# EAGLE design FilterSchematics1 (EAGLE 8.2.2)
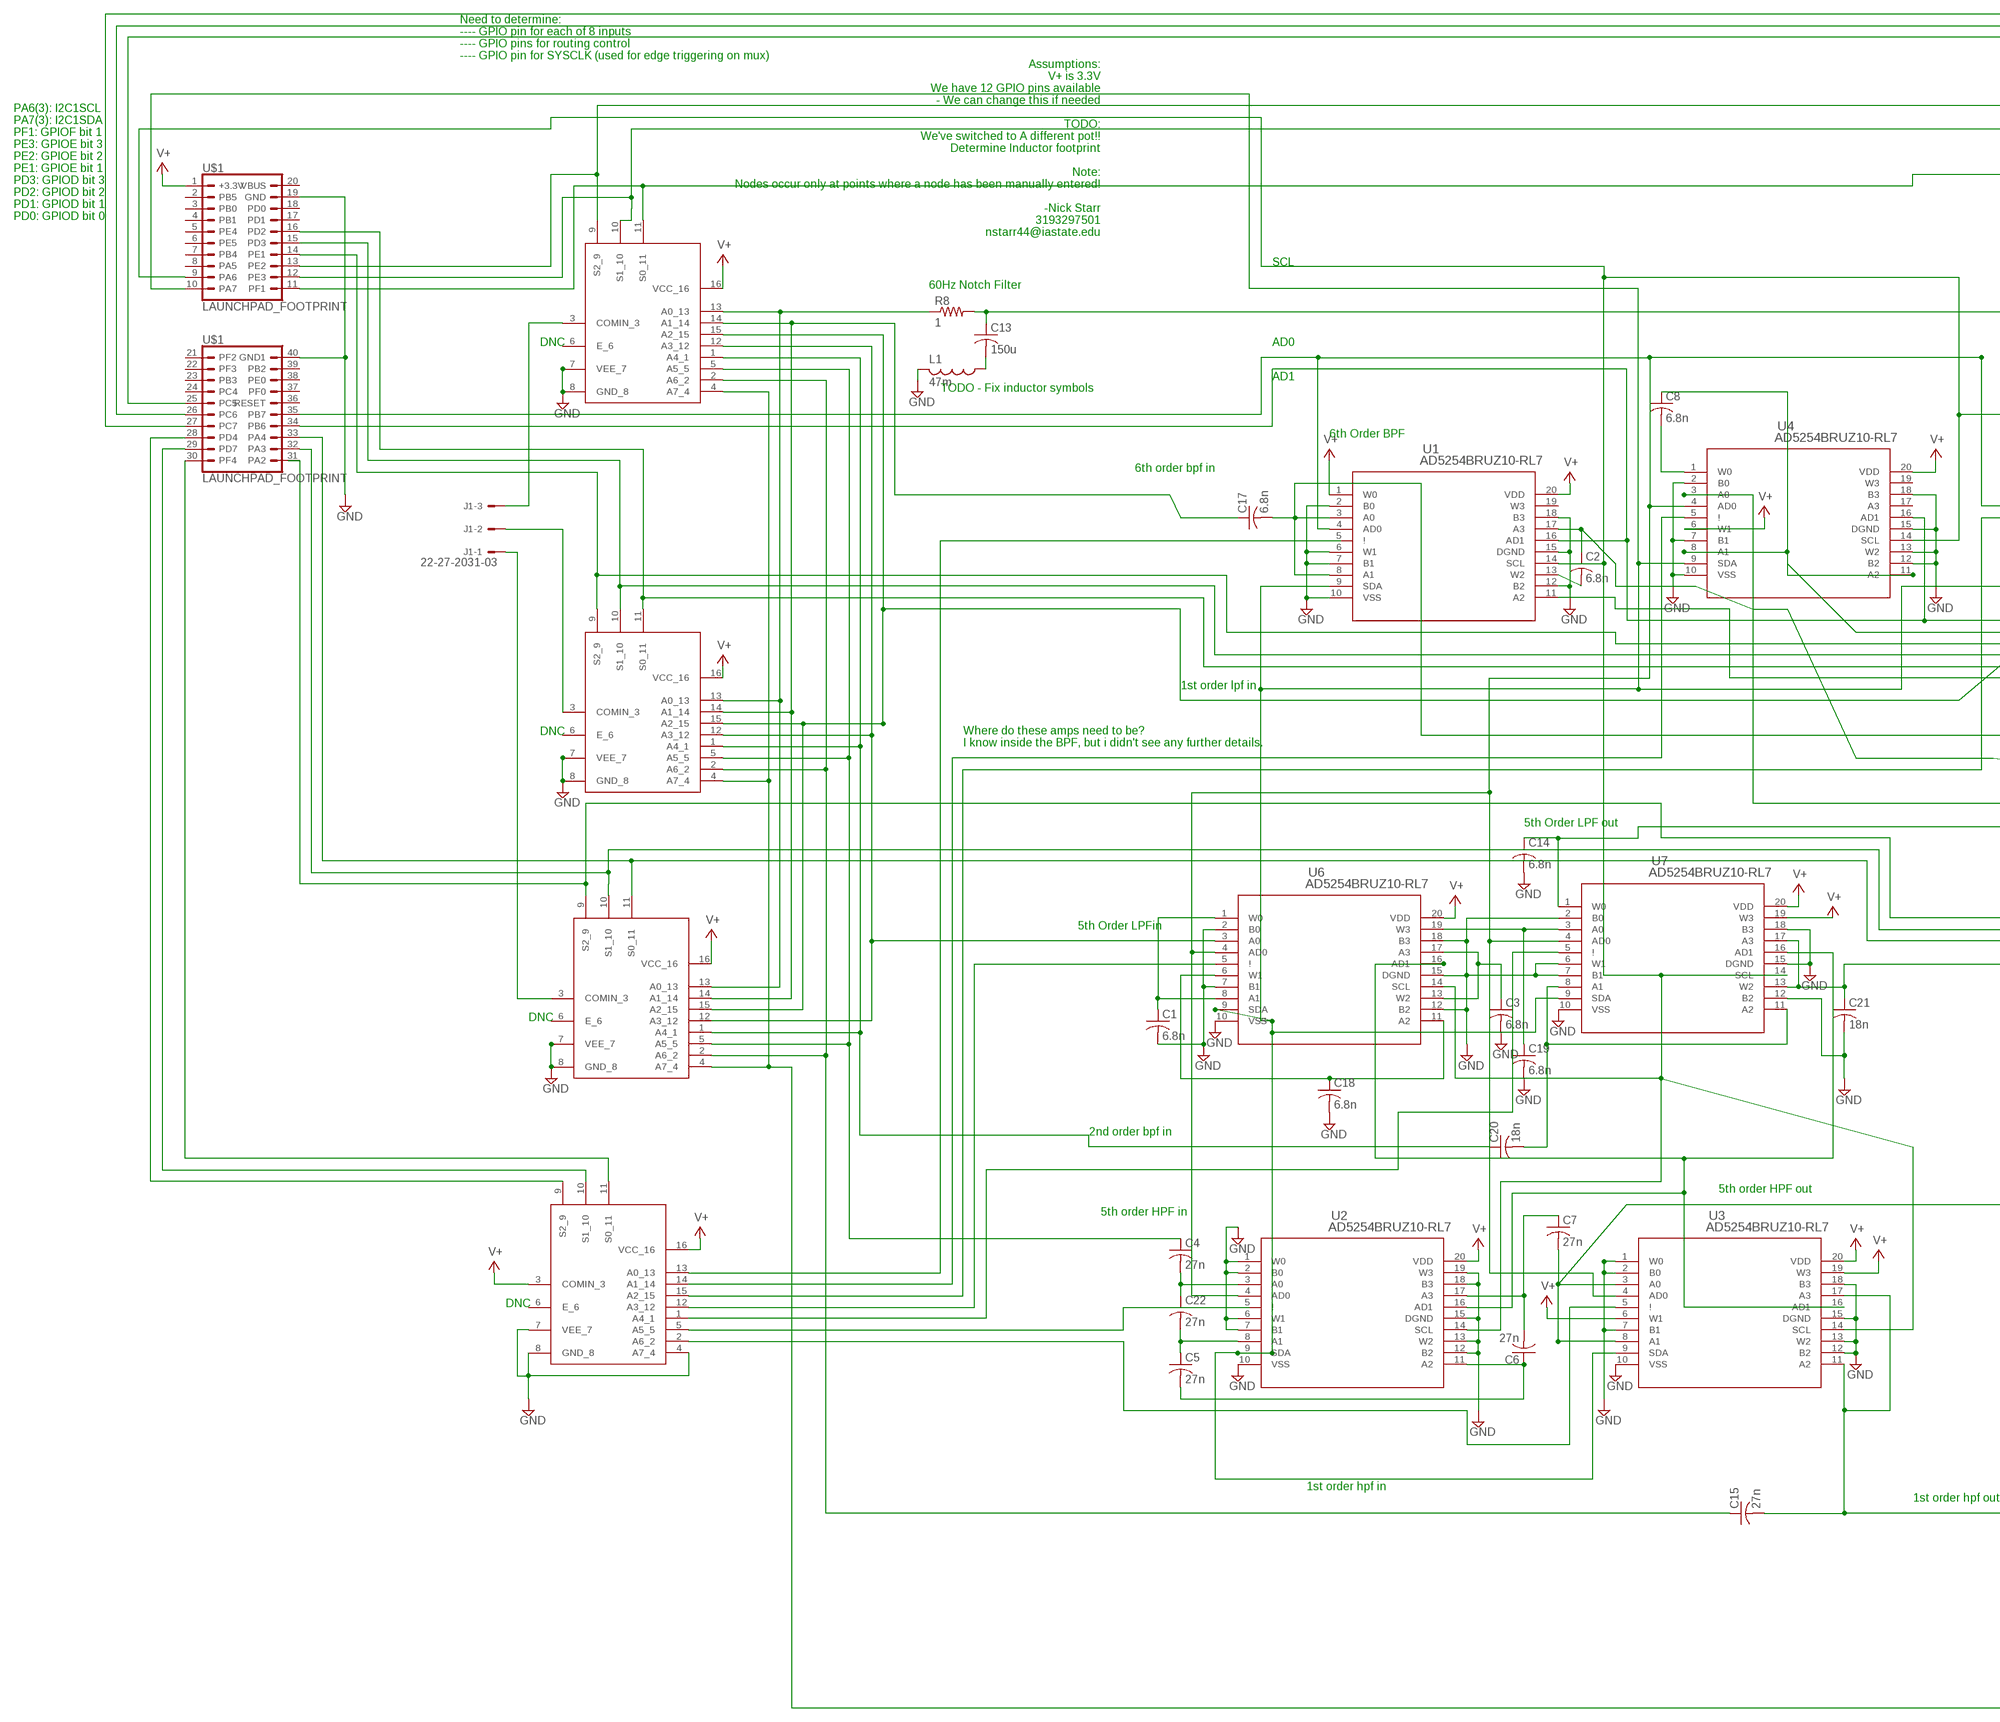
[diagram p0: schematic, sheet 1, part 1 of 2]
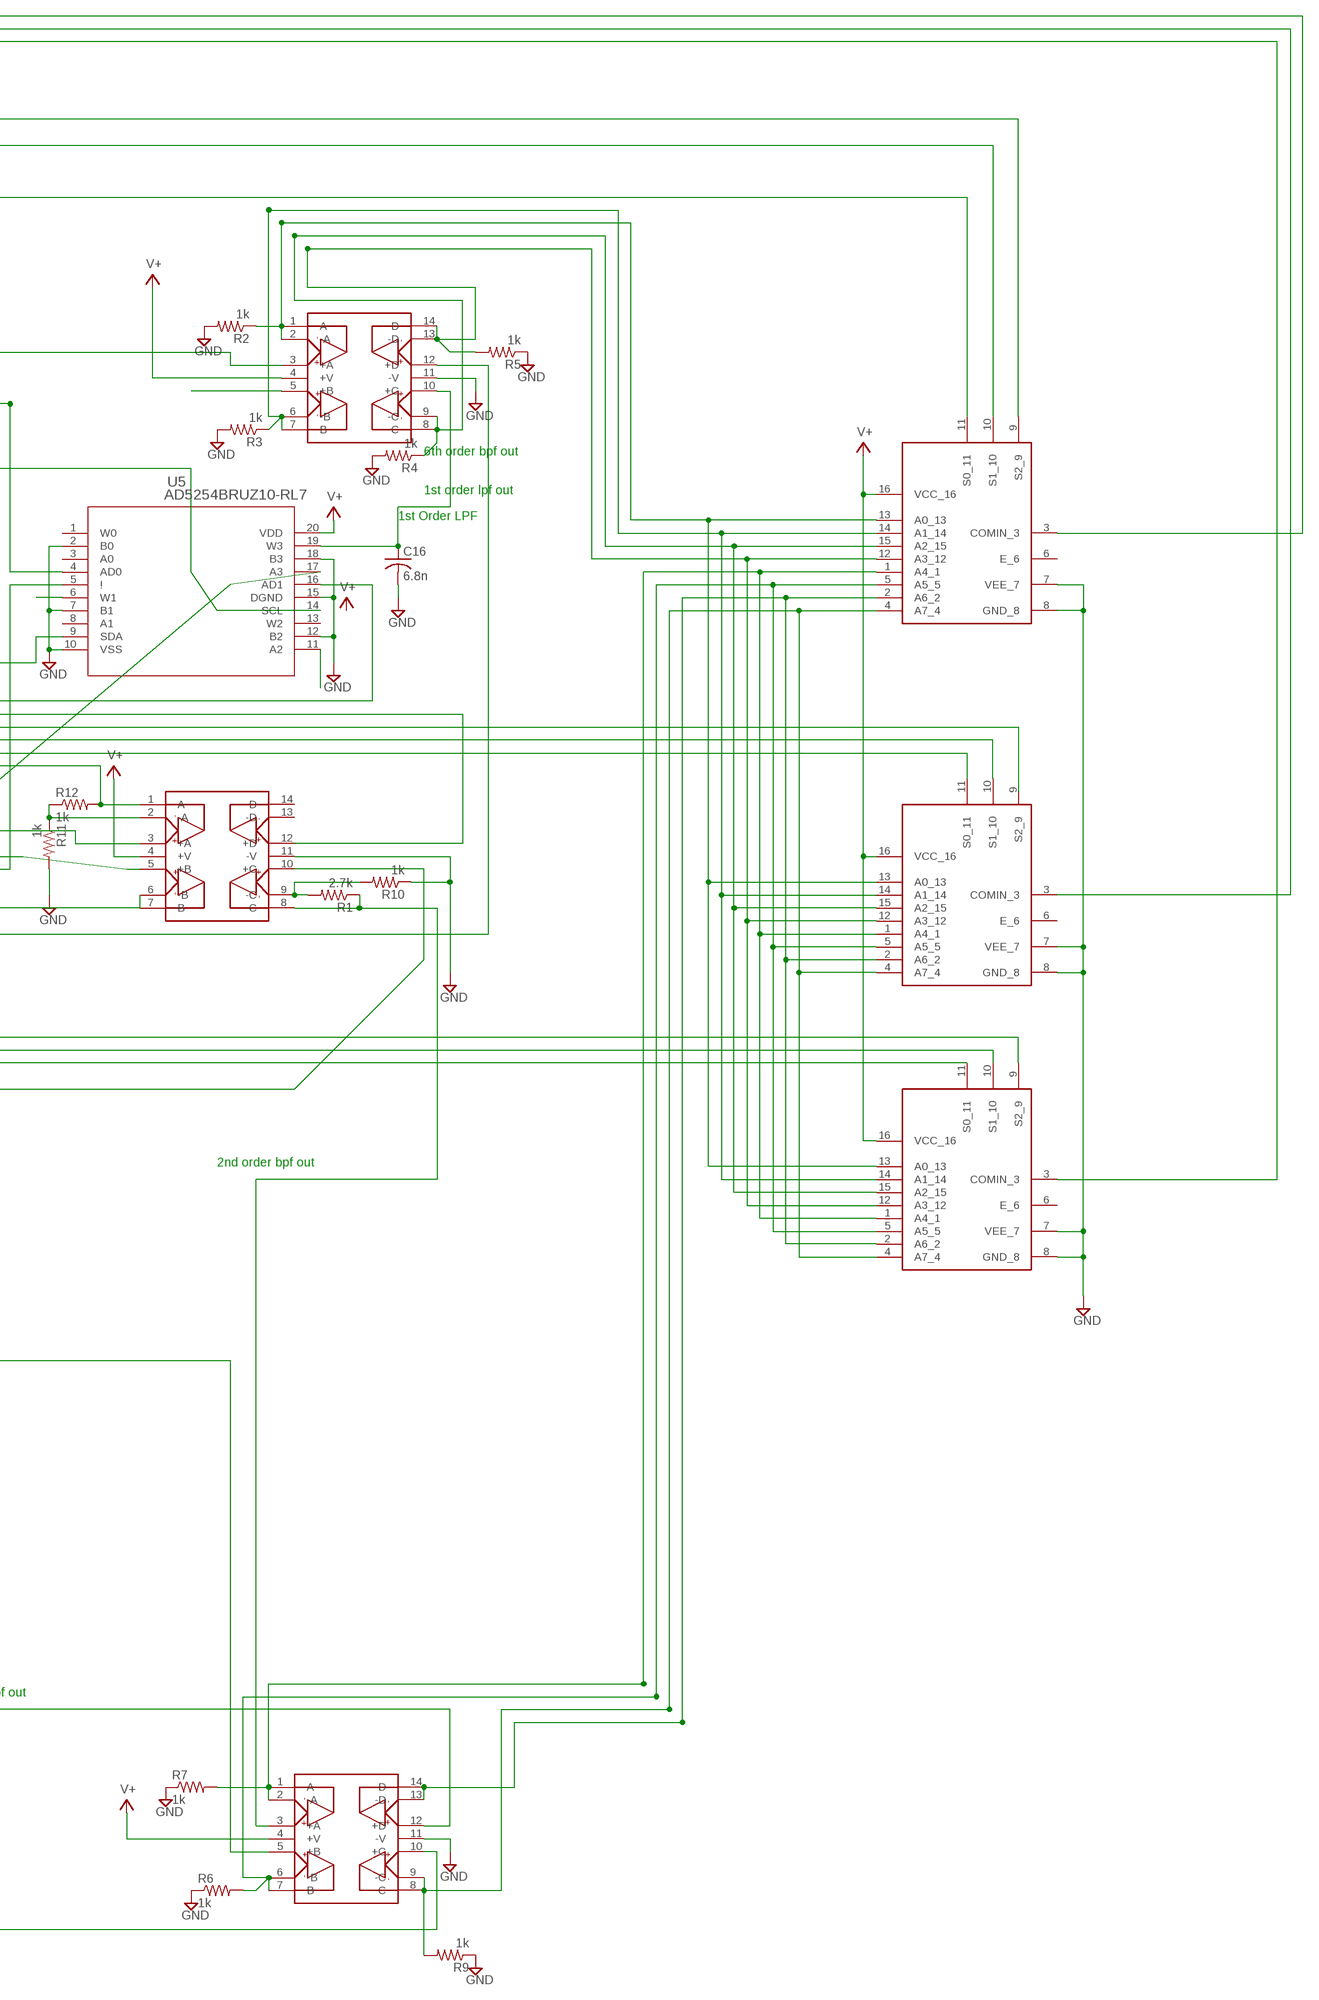
[diagram p1: schematic, sheet 1, part 2 of 2]

## Parts
C1  6.8n  C-USC0805  [C0805]
C2  6.8n  C-USC0805  [C0805]
C3  6.8n  C-USC0805  [C0805]
C4  27n  C-USC0805  [C0805]
C5  27n  C-USC0805  [C0805]
C6  27n  C-USC0805  [C0805]
C7  27n  C-USC0805  [C0805]
C8  6.8n  C-USC0805  [C0805]
C13  150u  C-USC0805  [C0805]
C14  6.8n  C-USC0805  [C0805]
C15  27n  C-USC0805  [C0805]
C16  6.8n  C-USC0805  [C0805]
C17  6.8n  C-USC0805  [C0805]
C18  6.8n  C-USC0805  [C0805]
C19  6.8n  C-USC0805  [C0805]
C20  18n  C-USC0805  [C0805]
C21  18n  C-USC0805  [C0805]
C22  27n  C-USC0805  [C0805]
J1  22-27-2031-03  [6410-03]
L1  47m  L-US0204/5  [0204/5]
R1  2.7k  R-US_R0805  [R0805]
R2  1k  R-US_R0805  [R0805]
R3  1k  R-US_R0805  [R0805]
R4  1k  R-US_R0805  [R0805]
R5  1k  R-US_R0805  [R0805]
R6  1k  R-US_R0805  [R0805]
R7  1k  R-US_R0805  [R0805]
R8  1  R-US_R0805  [R0805]
R9  1k  R-US_R0805  [R0805]
R10  1k  R-US_R0805  [R0805]
R11  1k  R-US_R0805  [R0805]
R12  1k  R-US_R0805  [R0805]
U1  AD5254BRUZ10-RL7  [RU_20]
U2  AD5254BRUZ10-RL7  [RU_20]
U3  AD5254BRUZ10-RL7  [RU_20]
U4  AD5254BRUZ10-RL7  [RU_20]
U5  AD5254BRUZ10-RL7  [RU_20]
U6  AD5254BRUZ10-RL7  [RU_20]
U7  AD5254BRUZ10-RL7  [RU_20]
U$1  LAUNCHPAD_FOOTPRINT  [SSW-110-02-S-D]
U$2  OPA4830  [TSSOP14]
U$3  CD74HC4051-Q1  [TSSOP16]
U$4  CD74HC4051-Q1  [TSSOP16]
U$5  CD74HC4051-Q1  [TSSOP16]
U$6  CD74HC4051-Q1  [TSSOP16]
U$21  CD74HC4051-Q1  [TSSOP16]
U$22  CD74HC4051-Q1  [TSSOP16]
U$23  CD74HC4051-Q1  [TSSOP16]
U$24  OPA4830  [TSSOP14]
U$25  OPA4830  [TSSOP14]

## Nets
GND: C1.2 C3.2 C14.2 C16.2 C18.2 C19.2 C21.2 L1.2 R2.2 R3.2 R4.2 R5.1 R6.1 R7.1 R9.1 R10.1 R11.2 U1.2(B0) U1.6(W1) U1.7(B1) U1.10(VSS) U1.12(B2) U1.15(DGND) U1.18(B3) U2.1(W0) U2.2(B0) U2.6(W1) U2.7(B1) U2.10(VSS) U2.12(B2) U2.13(W2) U2.15(DGND) U2.18(B3) U2.19(W3) U3.1(W0) U3.2(B0) U3.7(B1) U3.10(VSS) U3.12(B2) U3.13(W2) U3.15(DGND) U3.18(B3) U4.2(B0) U4.7(B1) U4.10(VSS) U4.12(B2) U4.13(W2) U4.15(DGND) U4.18(B3) U5.2(B0) U5.7(B1) U5.10(VSS) U5.12(B2) U5.15(DGND) U5.18(B3) U6.2(B0) U6.7(B1) U6.10(VSS) U6.12(B2) U6.15(DGND) U6.18(B3) U7.2(B0) U7.6(W1) U7.7(B1) U7.10(VSS) U7.12(B2) U7.15(DGND) U7.18(B3) U$1.19(GND) U$1.40(GND1) U$2.11(-V) U$3.7(VEE_7) U$3.8(GND_8) U$4.7(VEE_7) U$4.8(GND_8) U$5.7(VEE_7) U$5.8(GND_8) U$6.4(A7_4) U$6.7(VEE_7) U$6.8(GND_8) U$21.7(VEE_7) U$21.8(GND_8) U$22.8(GND_8) U$23.7(VEE_7) U$23.8(GND_8)
N$1: J1.3 U$21.3(COMIN_3)
N$2: J1.2 U$22.3(COMIN_3)
N$3: J1.1 U$23.3(COMIN_3)
N$4: U$1.11(PF1) U$3.11(S0_11) U$21.11(S0_11)
N$5: C5.1 C22.2 U2.8(A1)
N$6: C4.2 C22.1 U2.3(A0)
N$7: C5.2 C6.1 U2.11(A2)
N$8: U$1.12(PE3) U$3.10(S1_10) U$21.10(S1_10)
N$9: U$1.13(PE2) U$3.9(S2_9) U$21.9(S2_9)
N$10: U$1.16(PD2) U$4.11(S0_11) U$22.11(S0_11)
N$11: U$1.15(PD3) U$4.10(S1_10) U$22.10(S1_10)
N$12: C16.1 U5.19(W3) U$24.10(+C)
N$13: C13.1 R8.2 U$24.3(+A)
N$14: C13.2 L1.1
N$15: U5.17(A3) U$21.15(A2_15) U$22.15(A2_15) U$23.15(A2_15)
N$16: C15.1 U$21.2(A6_2) U$22.2(A6_2) U$23.2(A6_2)
N$17: C15.2 U3.11(A2) U3.17(A3) U$25.12(+D)
N$18: U6.3(A0) U$21.12(A3_12) U$22.12(A3_12) U$23.12(A3_12)
N$19: U$1.14(PE1) U$22.9(S2_9)
N$20: C1.1 U6.1(W0) U6.8(A1)
N$21: C3.1 U6.13(W2) U6.17(A3)
N$22: C18.1 U6.6(W1) U6.11(A2)
N$23: U$1.33(PA4) U$5.11(S0_11) U$23.11(S0_11)
N$24: R8.1 U$21.13(A0_13) U$22.13(A0_13) U$23.13(A0_13)
N$25: C17.1 U$21.14(A1_14) U$22.14(A1_14) U$23.14(A1_14)
N$26: U$1.32(PA3) U$5.10(S1_10) U$23.10(S1_10)
N$27: U$5.9(S2_9) U$23.9(S2_9)
N$28: R1.2 R10.2 U$2.9(-C)
N$29: C4.1 U$21.5(A5_5) U$22.5(A5_5) U$23.5(A5_5)
N$30: C21.1 U7.13(W2) U7.17(A3) U$2.10(+C)
N$31: U$21.4(A7_4) U$22.4(A7_4) U$23.4(A7_4) U$25.10(+C)
N$32: R1.1 U$2.8(C) U$25.3(+A)
N$33: U$6.13(A0_13)
N$34: U4.5(!) U$6.14(A1_14)
N$35: U5.5(!) U$6.15(A2_15)
N$36: U6.5(!) U$6.12(A3_12)
N$37: U7.5(!) U$6.1(A4_1)
N$38: U$6.5(A5_5)
N$39: R2.1 U$3.13(A0_13) U$4.13(A0_13) U$5.13(A0_13) U$24.1(A) U$24.2(-A)
N$40: R3.1 U$3.14(A1_14) U$4.14(A1_14) U$5.14(A1_14) U$24.6(-B) U$24.7(B)
N$41: C19.1 U6.19(W3) U7.3(A0)
N$42: R4.1 U$3.15(A2_15) U$4.15(A2_15) U$5.15(A2_15) U$24.8(C) U$24.9(-C)
N$43: R5.2 U$3.12(A3_12) U$4.12(A3_12) U$5.12(A3_12) U$24.13(-D) U$24.14(D)
N$44: U3.5(!) U$6.2(A6_2)
N$45: U5.11(A2)
N$46: R6.2 U$3.5(A5_5) U$4.5(A5_5) U$5.5(A5_5) U$25.6(-B) U$25.7(B)
N$47: R7.2 U$3.1(A4_1) U$4.1(A4_1) U$5.1(A4_1) U$25.1(A) U$25.2(-A)
N$48: U$3.2(A6_2) U$4.2(A6_2) U$5.2(A6_2) U$25.13(-D) U$25.14(D)
N$49: R9.2 U$3.4(A7_4) U$4.4(A7_4) U$5.4(A7_4) U$25.8(C) U$25.9(-C)
N$50: U$24.5(+B)
N$51: U1.14(SCL) U2.14(SCL) U3.14(SCL) U4.14(SCL) U5.14(SCL) U6.14(SCL) U7.14(SCL) U$1.9(PA6)
N$52: U1.16(AD1) U4.16(AD1) U5.16(AD1) U$1.34(PB6)
N$53: U1.4(AD0) U2.4(AD0) U3.4(AD0) U4.4(AD0) U5.4(AD0) U6.4(AD0) U7.4(AD0) U$1.35(PB7)
N$54: C17.2 U1.3(A0) U1.8(A1) U$2.3(+A)
N$55: U2.16(AD1) U3.16(AD1) U6.16(AD1) U7.16(AD1)
N$56: U$1.30(PF4) U$6.11(S0_11)
N$57: C14.1 U7.1(W0) U$24.12(+D)
N$58: U5.6(W1)
N$59: C20.1 U$21.1(A4_1) U$22.1(A4_1) U$23.1(A4_1)
N$60: C20.2 U7.8(A1) U7.11(A2)
N$61: U$22.7(VEE_7)
N$62: C6.2 C7.1 U2.17(A3)
N$63: U4.3(A0) U$2.6(-B) U$2.7(B)
N$64: U$1.25(PC5) U$5.3(COMIN_3)
N$65: U$1.26(PC6) U$4.3(COMIN_3)
N$66: U$1.28(PD4) U$6.9(S2_9)
N$67: C7.2 U3.3(A0) U3.8(A1) U$25.5(+B)
N$68: U$1.29(PD7) U$6.10(S1_10)
N$69: U$1.27(PC7) U$3.3(COMIN_3)
N$70: R11.1 R12.1 U$2.2(-A)
N$71: U1.9(SDA) U2.9(SDA) U3.9(SDA) U4.9(SDA) U5.9(SDA) U6.9(SDA) U7.9(SDA) U$1.10(PA7)
N$72: R12.2 U1.11(A2) U$2.1(A)
N$73: C2.1 U1.17(A3) U$2.5(+B)
N$74: C2.2 U1.13(W2)
N$75: C8.2 U4.1(W0)
N$77: C8.1 U4.8(A1) U4.11(A2) U$2.12(+D)
V+: U1.1(W0) U1.20(VDD) U2.20(VDD) U3.6(W1) U3.19(W3) U3.20(VDD) U4.6(W1) U4.20(VDD) U5.20(VDD) U6.20(VDD) U7.19(W3) U7.20(VDD) U$1.1(+3.3V) U$2.4(+V) U$3.16(VCC_16) U$4.16(VCC_16) U$5.16(VCC_16) U$6.3(COMIN_3) U$6.16(VCC_16) U$22.16(VCC_16) U$23.16(VCC_16) U$24.4(+V) U$25.4(+V)
V-: U$24.11(-V) U$25.11(-V) ; supply symbol labelled GND
Unconnected: U1.5(!) U1.19(W3) U2.5(!) U4.17(A3) U4.19(W3) U5.1(W0) U5.3(A0) U5.8(A1) U5.13(W2) U$1.2(PB5) U$1.3(PB0) U$1.4(PB1) U$1.5(PE4) U$1.6(PE5) U$1.7(PB4) U$1.8(PA5) U$1.17(PD1) U$1.18(PD0) U$1.20(VBUS) U$1.21(PF2) U$1.22(PF3) U$1.23(PB3) U$1.24(PC4) U$1.31(PA2) U$1.36(RESET) U$1.37(PF0) U$1.38(PE0) U$1.39(PB2) U$2.13(-D) U$2.14(D) U$3.6(E_6) U$4.6(E_6) U$4.9(S2_9) U$5.6(E_6) U$6.6(E_6) U$21.6(E_6) U$21.16(VCC_16) U$22.6(E_6) U$23.6(E_6)

## Notes on the sheet
- Assumptions:
  V+ is 3.3V
  We have 12 GPIO pins available
  - We can change this if needed
  
  TODO:
  We've switched to A different pot!!
  Determine Inductor footprint
  
  Note:
  Nodes occur only at points where a node has been manually entered!
  
  -Nick Starr
  3193297501
  nstarr44@iastate.edu
- Need to determine:
  ---- GPIO pin for each of 8 inputs
  ---- GPIO pins for routing control
  ---- GPIO pin for SYSCLK (used for edge triggering on mux)
- PA6(3): I2C1SCL
  PA7(3): I2C1SDA
  PF1: GPIOF bit 1
  PE3: GPIOE bit 3
  PE2: GPIOE bit 2
  PE1: GPIOE bit 1
  PD3: GPIOD bit 3
  PD2: GPIOD bit 2
  PD1: GPIOD bit 1
  PD0: GPIOD bit 0
- SCL
- 60Hz Notch Filter
- DNC | AD0
- AD1
- TODO - Fix inductor symbols
- 6th order bpf out
- 6th Order BPF | 1st order lpf out
- 1st Order LPF
- 6th order bpf in
- 1st order lpf in
- DNC
- Where do these amps need to be?
  I know inside the BPF, but i didn't see any further details.
- 5th Order LPF out
- 5th Order LPFin
- DNC
- 2nd order bpf out
- 2nd order bpf in
- 5th order HPF out
- 5th order HPF in
- DNC
- 1st order hpf in
- 1st order hpf out

## Library data of the parts
C1-C8 C13-C22 = rcl:C-US: CAPACITOR, American symbol
J1 = con-molex:22-?-03: CONNECTOR wire to board 2.54 mm (.1 inch) pitch header; OC_FARNELL: unknown; OC_NEWARK: unknown
L1 = rcl:L-US: INDUCTOR, American symbol
R1-R12 = rcl:R-US_: RESISTOR, American symbol
U1-U7 = 491Library:AD5254BRUZ10-RL7; MANUFACTURER_PART_NUMBER: AD5254BRUZ10RL7; VENDOR: Analog Devices Inc
U$1 = 491Library:LAUNCHPAD_FOOTPRINT
U$2 U$24 U$25 = 491Library:OPA4830
U$3-U$6 U$21-U$23 = 491Library:CD74HC4051-Q1

## Board
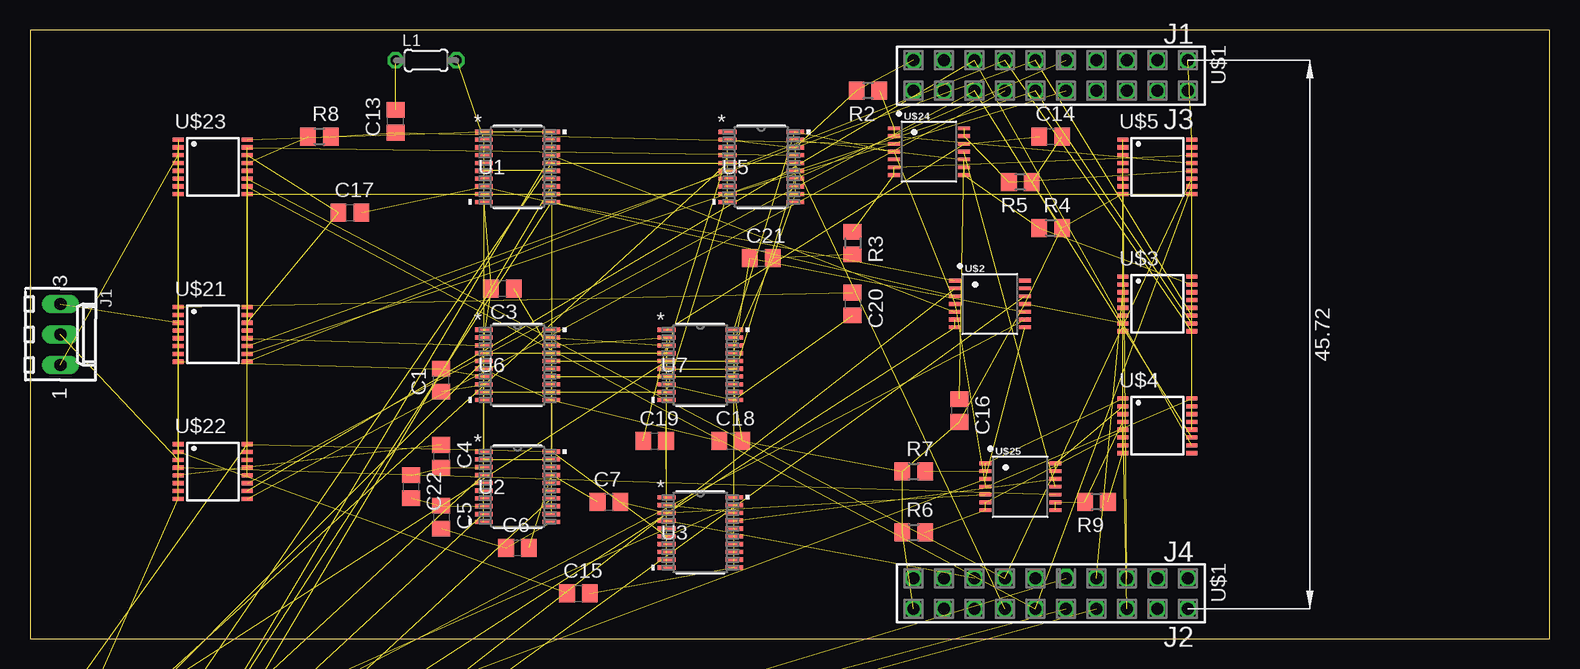
[diagram p2: board, top side]
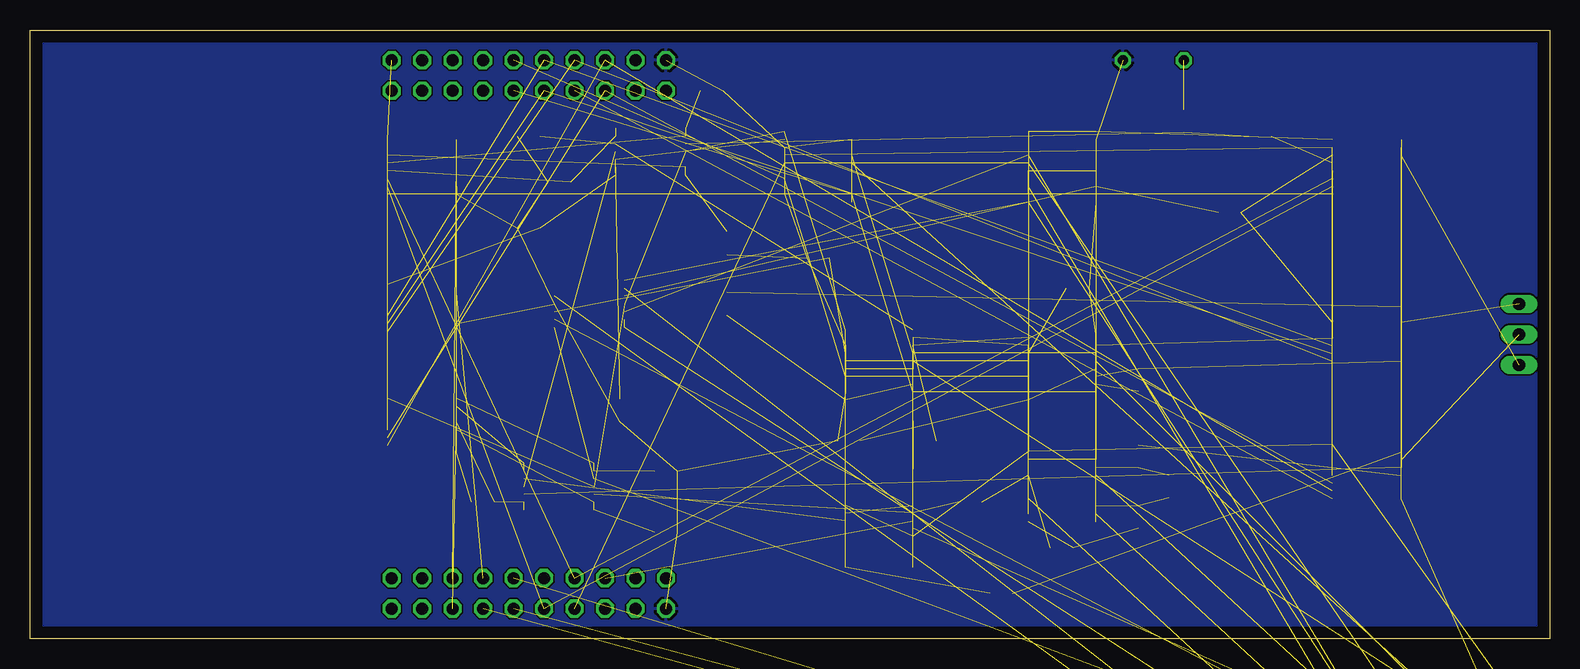
[diagram p3: board, bottom side, seen from below]

Size 126.67 x 50.79 mm. Coordinates in mm from the lower left corner, seen from the top.
Outline: 0,0 126.67,0 126.67,50.79 0,50.79 0,0
Copper layers (1*16): Top 0.035mm / dielectric 1.5mm / Bottom 0.035mm
Design rules "default": minimum track width 6mil, minimum drill 0.35mm, track to track 6mil, track to pad 6mil, pad to pad 6mil, via to via 6mil, smd to smd 6mil, copper to edge 40mil, drill to drill 6mil, minimum pad ring 10mil, minimum via ring 8mil, stop-mask expansion 4mil, vias tented up to drill 0mil, thermal gap 10mil

### Footprints (pad centres in the part's own frame; a part is rotated, then mirrored left to right if it is on the bottom)
C0805 = smd 1.3 x 1.5: 1 -0.95,0; 2 0.95,0
6410-03 = drill 1.016 long: 1 2.54,0; 2 0,0; 3 -2.54,0
0204/5 = drill 0.813 octagon: 1 -2.54,0; 2 2.54,0
R0805 = smd 1.3 x 1.5: 1 -0.95,0; 2 0.95,0
RU_20 = smd 1.473 x 0.356: 1 -2.819,2.925; 2 -2.819,2.275; 3 -2.819,1.625; 4 -2.819,0.975; 5 -2.819,0.325; 6 -2.819,-0.325; 7 -2.819,-0.975; 8 -2.819,-1.625; 9 -2.819,-2.275; 10 -2.819,-2.925; 11 2.819,-2.925; 12 2.819,-2.275; 13 2.819,-1.625; 14 2.819,-0.975; 15 2.819,-0.325; 16 2.819,0.325; 17 2.819,0.975; 18 2.819,1.625; 19 2.819,2.275; 20 2.819,2.925
SSW-110-02-S-D = drill 1 pad 1.5 octagon: 1 -22.86,11.43; 2 -20.32,11.43; 3 -22.86,8.89; 4 -20.32,8.89; 5 -22.86,6.35; 6 -20.32,6.35; 7 -22.86,3.81; 8 -20.32,3.81; 9 -22.86,1.27; 10 -20.32,1.27; 11 -22.86,-1.27; 12 -20.32,-1.27; 13 -22.86,-3.81; 14 -20.32,-3.81; 15 -22.86,-6.35; 16 -20.32,-6.35; 17 -22.86,-8.89; 18 -20.32,-8.89; 19 -22.86,-11.43; 20 -20.32,-11.43; 21 20.32,11.43; 22 22.86,11.43; 23 20.32,8.89; 24 22.86,8.89; 25 20.32,6.35; 26 22.86,6.35; 27 20.32,3.81; 28 22.86,3.81; 29 20.32,1.27; 30 22.86,1.27; 31 20.32,-1.27; 32 22.86,-1.27; 33 20.32,-3.81; 34 22.86,-3.81; 35 20.32,-6.35; 36 22.86,-6.35; 37 20.32,-8.89; 38 22.86,-8.89; 39 20.32,-11.43; 40 22.86,-11.43
TSSOP14 = smd 0.305 x 0.991: 1 -1.95,-2.918; 2 -1.3,-2.918; 3 -0.65,-2.918; 4 0,-2.918; 5 0.65,-2.918; 6 1.3,-2.918; 7 1.95,-2.918; 8 1.95,2.918; 9 1.3,2.918; 10 0.65,2.918; 11 0,2.918; 12 -0.65,2.918; 13 -1.3,2.918; 14 -1.95,2.918
TSSOP16 = smd 0.9 x 0.35: 1 -2.875,2.275; 2 -2.875,1.625; 3 -2.875,0.975; 4 -2.875,0.325; 5 -2.875,-0.325; 6 -2.875,-0.975; 7 -2.875,-1.625; 8 -2.875,-2.275; 9 2.875,-2.275; 10 2.875,-1.625; 11 2.875,-0.975; 12 2.875,-0.325; 13 2.875,0.325; 14 2.875,0.975; 15 2.875,1.625; 16 2.875,2.275

### Placement (x,y rotation side)
C1  34.29,21.59 90 top
C2  -11.43,-53.34 0 top  (outside the outline)
C3  39.37,29.21 180 top
C4  34.29,15.24 270 top
C5  34.29,10.16 270 top
C6  40.64,7.62 0 top
C7  48.26,11.43 0 top
C8  -11.43,-59.69 0 top  (outside the outline)
C13  30.48,43.18 90 top
C14  85.09,41.91 0 top
C15  45.72,3.81 0 top
C16  77.47,19.05 270 top
C17  26.67,35.56 0 top
C18  58.42,16.51 0 top
C19  52.07,16.51 0 top
C20  68.58,27.94 270 top
C21  60.96,31.75 0 top
C22  31.75,12.7 270 top
J1  2.54,25.4 270 top
L1  33.02,48.26 0 top
R1  -2.54,-17.78 0 top  (outside the outline)
R2  69.85,45.72 180 top
R3  68.58,33.02 270 top
R4  85.09,34.29 0 top
R5  82.55,38.1 180 top
R6  73.66,8.89 0 top
R7  73.66,13.97 0 top
R8  24.13,41.91 0 top
R9  88.9,11.43 180 top
R10  -2.54,-24.13 0 top  (outside the outline)
R11  -11.43,-40.64 0 top  (outside the outline)
R12  -11.43,-46.99 0 top  (outside the outline)
U1  40.64,39.37 0 top
U2  40.64,12.7 0 top
U3  55.88,8.89 0 top
U4  -8.89,-33.02 0 top  (outside the outline)
U5  60.96,39.37 0 top
U6  40.64,22.86 0 top
U7  55.88,22.86 0 top
U$1  85.09,25.4 270 top
U$2  80.01,27.94 270 top
U$3  93.98,27.94 0 top
U$4  93.98,17.78 0 top
U$5  93.98,39.37 0 top
U$6  -10.16,-21.59 0 top  (outside the outline)
U$21  15.24,25.4 0 top
U$22  15.24,13.97 0 top
U$23  15.24,39.37 0 top
U$24  74.93,40.64 270 top
U$25  82.55,12.7 270 top

### Tracks (layer width: path | path; a pad name or v marks a point on that pad's centre or on a via)
GND  (84 unrouted)
  pour Bottom: 0,50.8 0,0 127,0 127,50.8
N$1  (1 unrouted)
N$2  (1 unrouted)
N$3  (1 unrouted)
N$4  (2 unrouted)
N$5  (2 unrouted)
N$6  (2 unrouted)
N$7  (2 unrouted)
N$8  (2 unrouted)
N$9  (2 unrouted)
N$10  (2 unrouted)
N$11  (2 unrouted)
N$12  (2 unrouted)
N$13  (2 unrouted)
N$14  (1 unrouted)
N$15  (3 unrouted)
N$16  (3 unrouted)
N$17  (3 unrouted)
N$18  (3 unrouted)
N$19  (1 unrouted)
N$20  (2 unrouted)
N$21  (2 unrouted)
N$22  (2 unrouted)
N$23  (2 unrouted)
N$24  (3 unrouted)
N$25  (3 unrouted)
N$26  (2 unrouted)
N$27  (1 unrouted)
N$28  (2 unrouted)
N$29  (3 unrouted)
N$30  (3 unrouted)
N$31  (3 unrouted)
N$32  (2 unrouted)
N$34  (1 unrouted)
N$35  (1 unrouted)
N$36  (1 unrouted)
N$37  (1 unrouted)
N$39  (5 unrouted)
N$40  (5 unrouted)
N$41  (2 unrouted)
N$42  (5 unrouted)
N$43  (5 unrouted)
N$44  (1 unrouted)
N$46  (5 unrouted)
N$47  (5 unrouted)
N$48  (4 unrouted)
N$49  (5 unrouted)
N$51  (7 unrouted)
N$52  (3 unrouted)
N$53  (7 unrouted)
N$54  (3 unrouted)
N$55  (3 unrouted)
N$56  (1 unrouted)
N$57  (2 unrouted)
N$59  (3 unrouted)
N$60  (2 unrouted)
N$62  (2 unrouted)
N$63  (2 unrouted)
N$64  (1 unrouted)
N$65  (1 unrouted)
N$66  (1 unrouted)
N$67  (3 unrouted)
N$68  (1 unrouted)
N$69  (1 unrouted)
N$70  (2 unrouted)
N$71  (7 unrouted)
N$72  (2 unrouted)
N$73  (2 unrouted)
N$74  (1 unrouted)
N$75  (1 unrouted)
N$77  (3 unrouted)
V+  (22 unrouted)
V-  (1 unrouted)